# EAGLE design ws2812_Triangle (EAGLE 8.7.1)
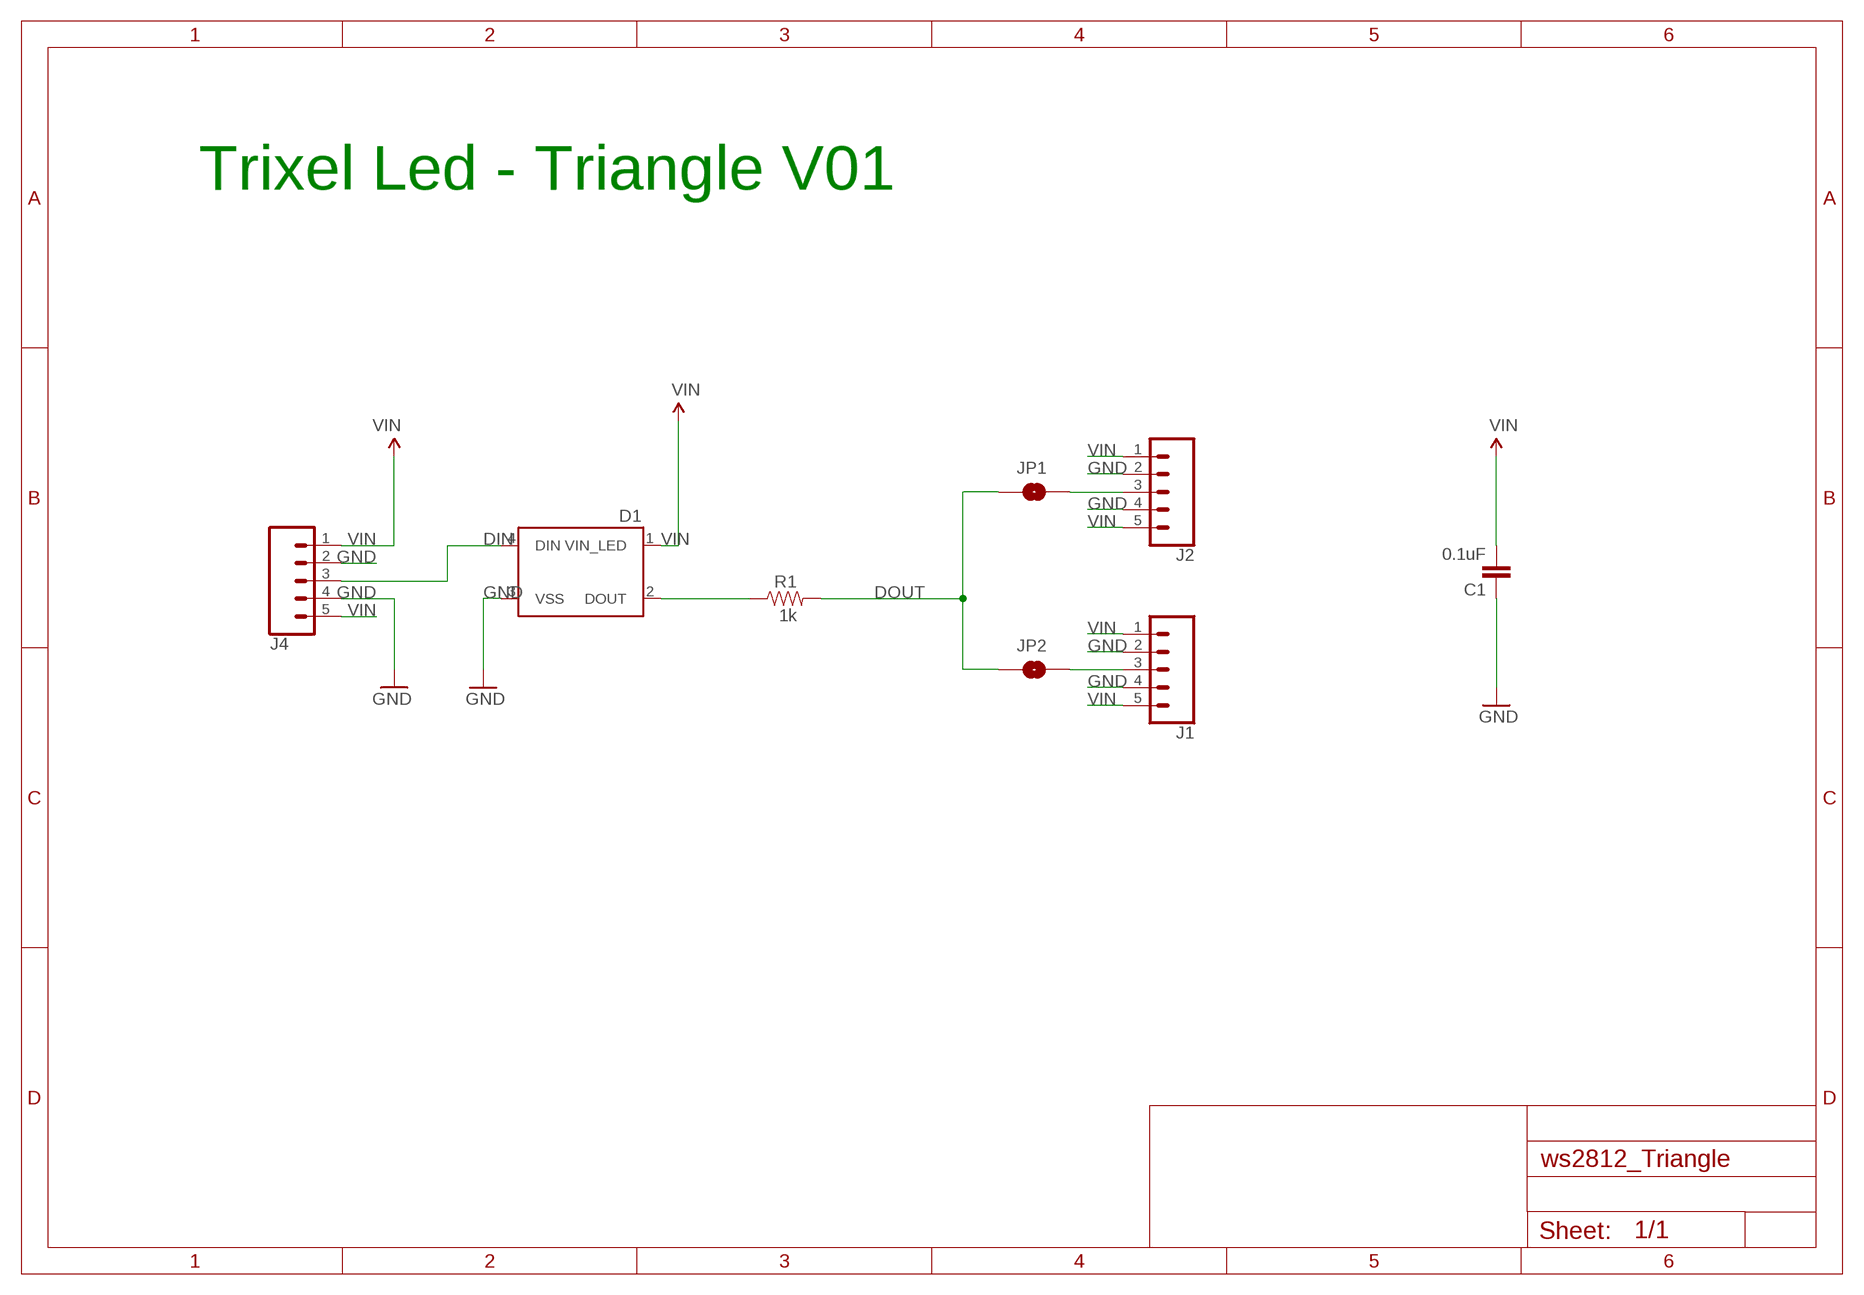
[diagram p0: schematic, sheet 1]

## Parts
C1  0.1uF  CAP0805  [0805]
D1  WS2812B  [WS2812B]
J1  CONN_05PTH_LONGPADS  [1X05_LONGPADS]
J2  CONN_05PTH_LONGPADS  [1X05_LONGPADS]
J4  CONN_05PTH_LONGPADS  [1X05_LONGPADS]
JP1  JUMPER-PAD-2-NOYES_SILK  [PAD-JUMPER-2-NO_YES_SILK]
JP2  JUMPER-PAD-2-NOYES_SILK  [PAD-JUMPER-2-NO_YES_SILK]
R1  1k  RESISTOR0805  [0805]

## Nets
DIN: D1.4(DIN) J4.3
DOUT: JP1.1 JP2.1 R1.2
GND: C1.1 D1.3(VSS) J1.2 J1.4 J2.2 J2.4 J4.2 J4.4
N$1: J1.3 JP2.2
N$2: J2.3 JP1.2
N$3: D1.2(DOUT) R1.1
VIN: C1.2 D1.1(VIN_LED) J1.1 J1.5 J2.1 J2.5 J4.1 J4.5

## Notes on the sheet
- Trixel Led - Triangle V01

## Library data of the parts
C1 = SparkFun-Capacitors:CAP: Capacitor Standard 0603 ceramic capacitor, and 0.1" leaded capacitor.
D1 = SparkFun-LED:WS2812B: WS2812B - Intelligent control LED integrated light source Technical Specifications: Power Supply Voltage (VDD): 3.5 to 5.3 V Input Voltage (VI): -0.5 to VDD+0.5 V Operating Junction Temperature (Topt): -25°C to +80°C Storage Temperature Range (Tstg): -55°C to +150°C; PROD_ID: DIO-12503
J1 J2 J4 = SparkFun-Connectors:CONN_05: Multi connection point. Often used as Generic Header-pin footprint for 0.1 inch spaced/style header connections On any of the 0.1 inch spaced packages, you can populate with these: Break Away Headers - Straight <https://www.sparkfun.com/products/116> (PRT-00116) Break Away Male Headers - Right Angle <https://www.sparkfun.com/products/553> (PRT-00553) Female Headers <https://www.sparkfun.com/products/115> (PRT-00115) Break Away Headers - Machine Pin <https://www.sparkfun.com/products/117> (PRT-00117) Break Away Female Headers - Swiss Machine Pin <https://www.sparkfun.com/products/743> (PRT-00743) For SCREWTERMINALS and SPRING TERMINALS visit here: Screw Terimnals on SparkFun.com <https://www.sparkfun.com/search/results?term=Screw+Terminals> (5mm/3.5mm/2.54mm spacing) This device is also useful as a general connection point to wire up your design to another part of your project. Our various solder wires solder well into these plated through hole pads. Hook-Up Wire - Assortment (Stranded, 22 AWG) <https://www.sparkfun.com/products/11375> (PRT-11375) Hook-Up Wire - Assortment (Solid Core, 22 AWG) <https://www.sparkfun.com/products/11367> (PRT-11367) View the entire wire category on our website here <https://www.sparkfun.com/categories/141> Special notes: Molex polarized connector foot print use with SKU : PRT-08231 with associated crimp pins and housings. 1MM SMD Version SKU: PRT-10208
JP1 JP2 = SparkFun-Passives:JUMPER-PAD-2-NO
R1 = SparkFun-Resistors:RESISTOR: Generic Resistor Package

## Board
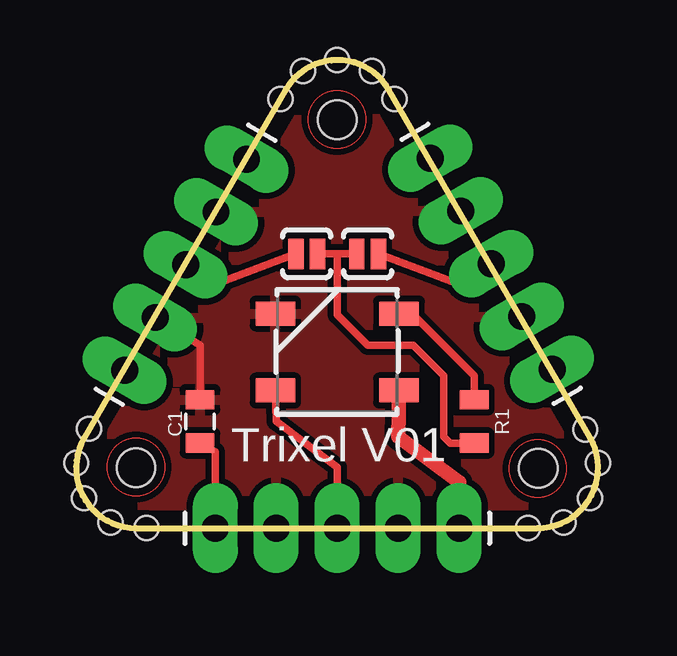
[diagram p1: board, top side]
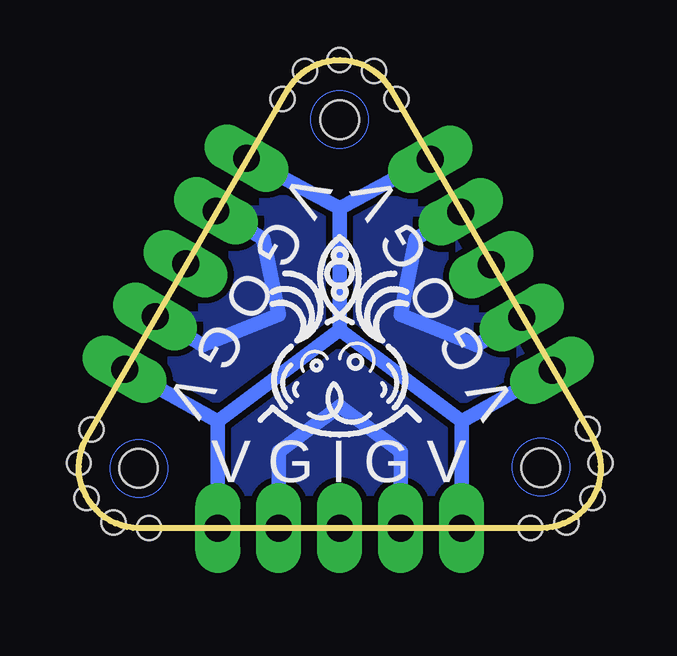
[diagram p2: board, bottom side, seen from below]

Size 21.75 x 19.5 mm. Coordinates in mm from the lower left corner, seen from the top.
Outline: 2.5,0 19.23,0 arc120 21.42,3.76 13.04,18.26 arc121 8.72,18.24 0.34,3.76 arc120 2.5,0
Copper layers (1*16): Top 0.035mm / dielectric 1.5mm / Bottom 0.035mm
Design rules "SeeedStudio_2layer_DRU_no_angle_20140221 *": minimum track width 6mil, minimum drill 12mil, track to track 6mil, track to pad 6mil, pad to pad 6mil, via to via 6mil, smd to smd 0mil, copper to edge 10mil, drill to drill 10mil, minimum pad ring 10mil, minimum via ring 6mil, stop-mask expansion 2mil, vias tented up to drill 20mil, thermal gap 10mil
Holes 1.6 mm at 2.5,2.51 10.88,17.02 19.26,2.49
Holes 1 mm at 0.54,4.14 0.01,2.72 0.34,1.24 1.43,0.23 2.93,0 18.83,0 20.3,0.23 21.42,1.24 21.75,2.72 21.21,4.11 13.26,17.88 12.32,19.05 10.88,19.51 9.45,19.05 8.51,17.88

### Footprints (pad centres in the part's own frame; a part is rotated, then mirrored left to right if it is on the bottom)
0805 = smd 0.8 x 1.2: 1 -0.9,0; 2 0.9,0
WS2812B = smd 1.651 x 1: 1 -2.577,1.6; 2 -2.577,-1.6; 3 2.577,-1.6; 4 2.577,1.6
1X05_LONGPADS = drill 1.118 pad 1.88 long: 1 0,0; 2 2.54,0; 3 5.08,0; 4 7.62,0; 5 10.16,0
PAD-JUMPER-2-NO_YES_SILK = smd 0.635 x 1.27: 1 -0.45,0; 2 0.45,0

### Placement (x,y rotation side)
C1  5.16,4.45 270 top
D1  10.88,7.34 180 top
J1  19.84,6.62 120 top
J2  2.02,6.57 60 top
J4  5.8,0 0 top
JP1  9.61,11.43 180 top
JP2  12.15,11.43 0 top
R1  16.59,4.45 270 top

### Tracks (layer width: path | path; a pad name or v marks a point on that pad's centre or on a via)
DIN
  Top 0.305: J4.3 10.88,2.54 8.34,4.45 D1.4
DOUT
  Top 0.305: R1.2 15.59,3.54 15.32,3.81 15.32,6.35 14.05,7.62 12.15,7.62 10.88,8.89 10.88,11.43 | 10.88,11.43 JP2.1 | 10.88,11.43 JP1.1
GND
  Top 0.305: C1.1 5.16,7.62 J2.2
  Bottom 0.61: J4.2 8.34,3.17 10.88,5.08 13.42,3.17 J4.4 | J2.2 5.16,7.62 8.34,8.89 7.7,12.06 J2.4 | J1.2 16.59,7.62 13.42,8.89 14.05,12.06 J1.4
  pour Bottom (isolate 0.254): 2.62,0.95 19.13,0.95 20.4,3.49 12.46,17.14 9.29,17.14 1.35,3.81
  pour Top (isolate 0.254): 2.62,0.95 19.13,0.95 20.4,3.49 12.46,17.14 9.29,17.14 1.35,3.81
N$1
  Top 0.305: JP2.2 15.96,10.16 J1.3
N$2
  Top 0.305: J2.3 5.8,10.16 JP1.2
N$3
  Top 0.305: R1.1 16.59,6.35 14.05,8.89 D1.2
VIN
  Top 0.305: C1.2 5.8,3.17 J4.1
  Top 0.61: J4.5 15.96,1.91 13.42,3.81 D1.1
  Bottom 0.61: J4.5 15.96,4.45 | 15.96,4.45 J1.1 | J4.1 5.8,4.45 | J2.5 10.88,13.34 | 10.88,13.34 J1.5 | 5.8,4.45 10.88,8.26 | 10.88,8.26 10.88,13.34 | 10.88,8.26 15.96,4.45 | 5.8,4.45 J2.1
(copper drawn outside any net)
  shapes: Bottom circle x3, Top circle x3

### Text on the board
tPlace: Trixel V01
bPlace: V G O G V | V G O G V | V G I G V